# EAGLE design atmt (EAGLE 9.6.2)

## Sheet 1 of 2: MCU and power
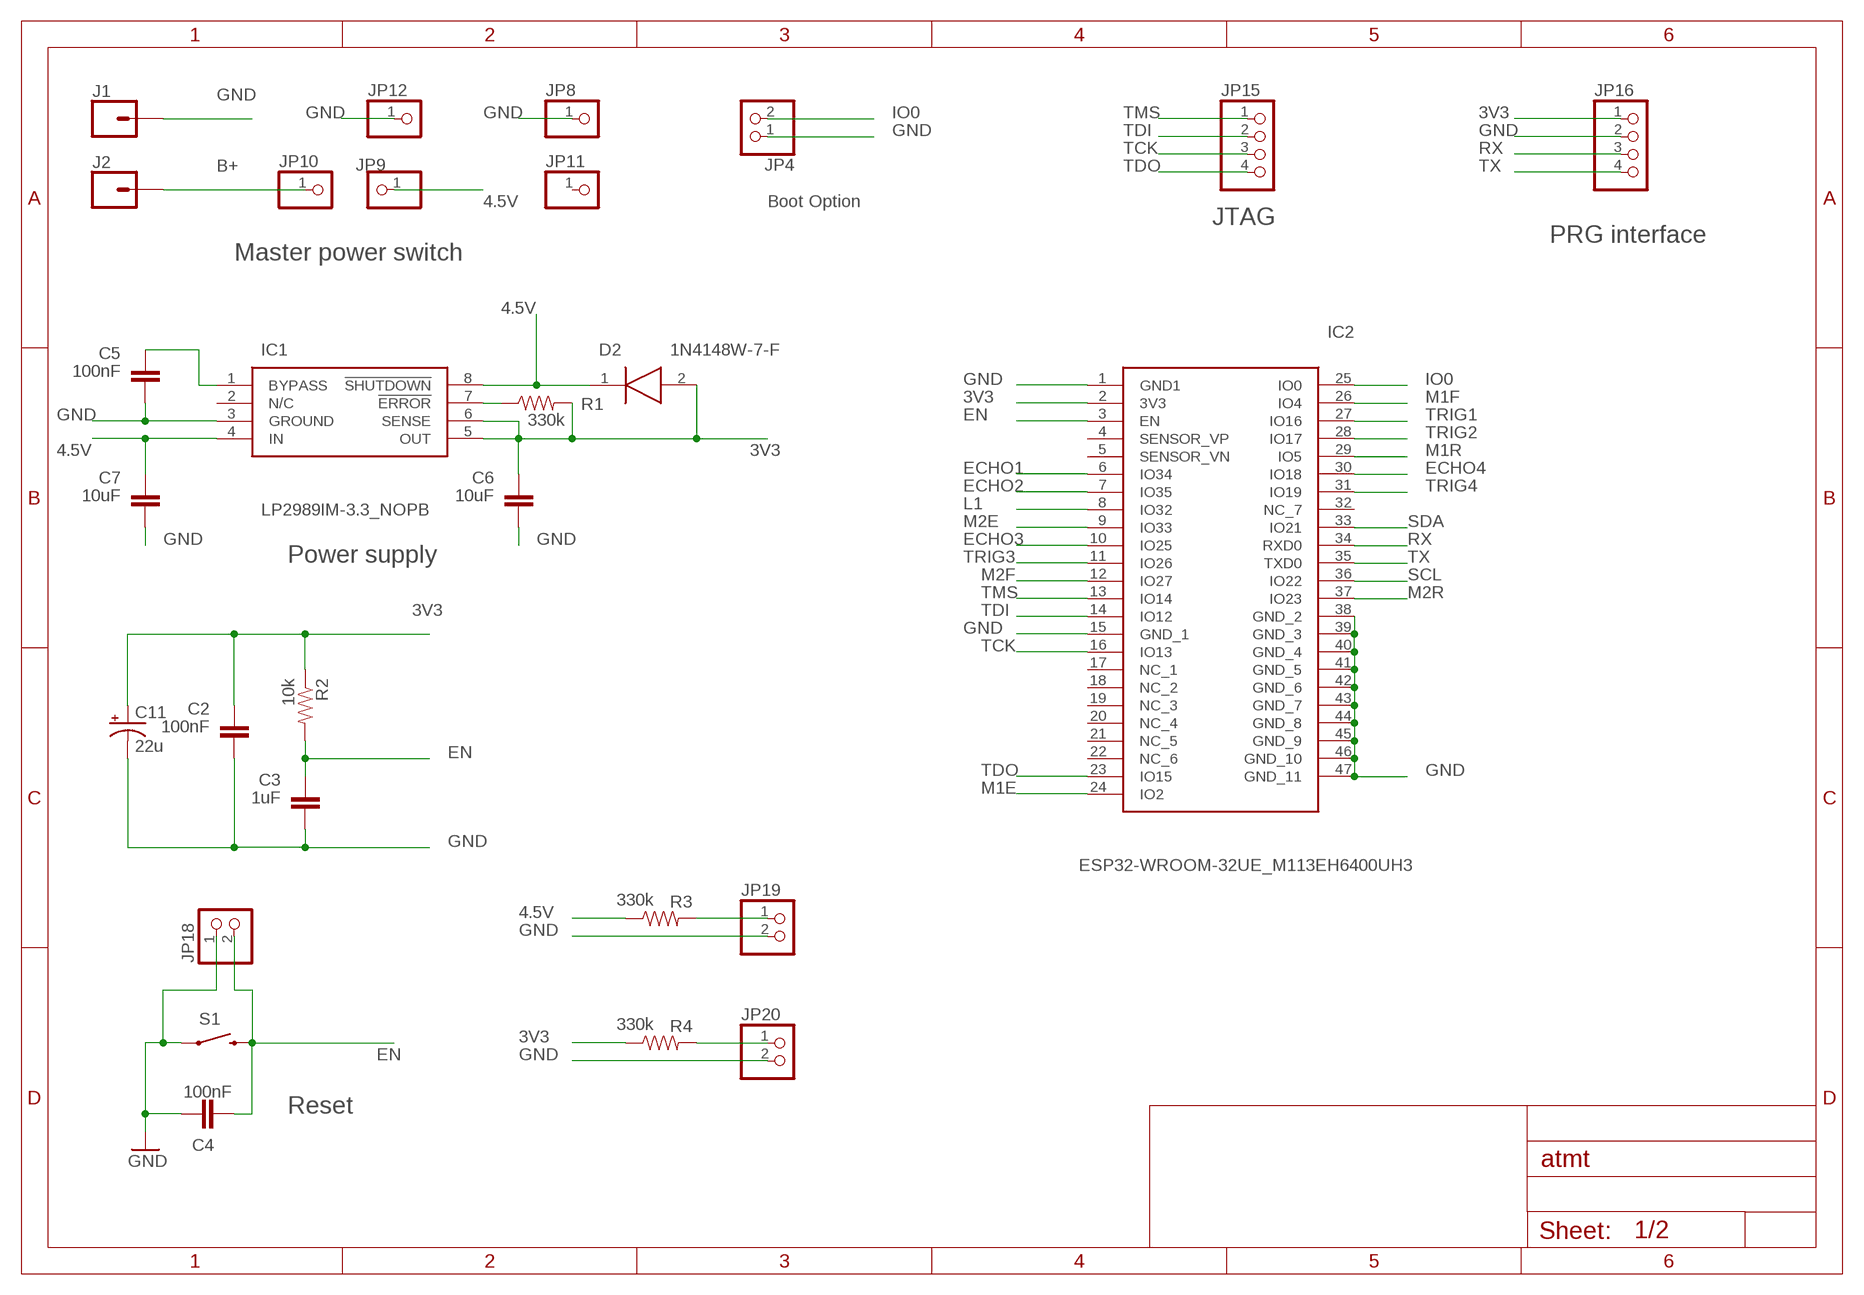
[diagram p0: schematic, sheet 1]

### Parts
C2  100nF  CAP0805  [0805]
C3  1uF  CAP0805  [0805]
C4  100nF  CAP0805  [0805]
C5  100nF  CAP0805  [0805]
C6  10uF  CAP0805  [0805]
C7  10uF  CAP0805  [0805]
C11  22u  CPOL-USE2-5  [E2-5]
D2  1N4148W-7-F  [SOD3716X115N]
IC1  LP2989IM-3.3_NOPB  [SOIC127P600X175-8N]
IC2  ESP32-WROOM-32UE_M113EH6400UH3  [ESP32WROOM32UEM113EH6400UH3Q0]
J1  CONN_01PTH_2MM  [1X01_2MM]
J2  CONN_01PTH_2MM  [1X01_2MM]
JP4  PINHD-1X2  [1X02]
JP8  PINHD-1X1  [1X01]
JP9  PINHD-1X1  [1X01]
JP10  PINHD-1X1  [1X01]
JP11  PINHD-1X1  [1X01]
JP12  PINHD-1X1  [1X01]
JP15  PINHD-1X4  [1X04]
JP16  PINHD-1X4  [1X04]
JP18  PINHD-1X2  [1X02]
JP19  PINHD-1X2  [1X02]
JP20  PINHD-1X2  [1X02]
R1  330k  RESISTOR0805-RES  [0805]
R2  10k  RESISTOR0805-RES  [0805]
R3  330k  RESISTOR0805-RES  [0805]
R4  330k  RESISTOR0805-RES  [0805]
S1  RESET  SWITCH-MOMENTARY-2SMD-1101NE  [TACTILE-SWITCH-1101NE]

### Nets
3V3: C2.1 C6.1 C11.+ D2.2(A) IC1.5(OUT) IC1.6(SENSE) IC2.2(3V3) JP16.1 R1.2 R2.1 R4.1 ; also sheet 2
4.5V: C7.1 D2.1(K) IC1.4(IN) IC1.8(!SHUTDOWN) JP9.1 R3.1 ; also sheet 2
B+: J2.1 JP10.1
ECHO1: IC2.6(IO34) ; also sheet 2
ECHO2: IC2.7(IO35) ; also sheet 2
ECHO3: IC2.10(IO25) ; also sheet 2
ECHO4: IC2.30(IO18) ; also sheet 2
EN: C3.1 C4.2 IC2.3(EN) JP18.2 R2.2 S1.2
GND: C2.2 C3.2 C4.1 C5.2 C6.2 C7.2 C11.- IC1.3(GROUND) IC2.1(GND1) IC2.15(GND_1) IC2.38(GND_2) IC2.39(GND_3) IC2.40(GND_4) IC2.41(GND_5) IC2.42(GND_6) IC2.43(GND_7) IC2.44(GND_8) IC2.45(GND_9) IC2.46(GND_10) IC2.47(GND_11) J1.1 JP4.1 JP8.1 JP12.1 JP16.2 JP18.1 JP19.2 JP20.2 S1.1 ; also sheet 2
IO0: IC2.25(IO0) JP4.2
L1: IC2.8(IO32) ; also sheet 2
M1E: IC2.24(IO2) ; also sheet 2
M1F: IC2.26(IO4) ; also sheet 2
M1R: IC2.29(IO5) ; also sheet 2
M2E: IC2.9(IO33) ; also sheet 2
M2F: IC2.12(IO27) ; also sheet 2
M2R: IC2.37(IO23) ; also sheet 2
N$1: C5.1 IC1.1(BYPASS)
N$2: JP19.1 R3.2
N$3: JP20.1 R4.2
N$4: IC1.7(!ERROR) R1.1
RX: IC2.34(RXD0) JP16.3
SCL: IC2.36(IO22) ; also sheet 2
SDA: IC2.33(IO21) ; also sheet 2
TCK: IC2.16(IO13) JP15.3
TDI: IC2.14(IO12) JP15.2
TDO: IC2.23(IO15) JP15.4
TMS: IC2.13(IO14) JP15.1
TRIG1: IC2.27(IO16) ; also sheet 2
TRIG2: IC2.28(IO17) ; also sheet 2
TRIG3: IC2.11(IO26) ; also sheet 2
TRIG4: IC2.31(IO19) ; also sheet 2
TX: IC2.35(TXD0) JP16.4
Unconnected: IC1.2(N/C) IC2.4(SENSOR_VP) IC2.5(SENSOR_VN) IC2.17(NC_1) IC2.18(NC_2) IC2.19(NC_3) IC2.20(NC_4) IC2.21(NC_5) IC2.22(NC_6) IC2.32(NC_7) JP11.1

### Notes on the sheet
- Boot Option
- JTAG
- PRG interface
- Master power switch
- Power supply
- Reset

## Sheet 2 of 2
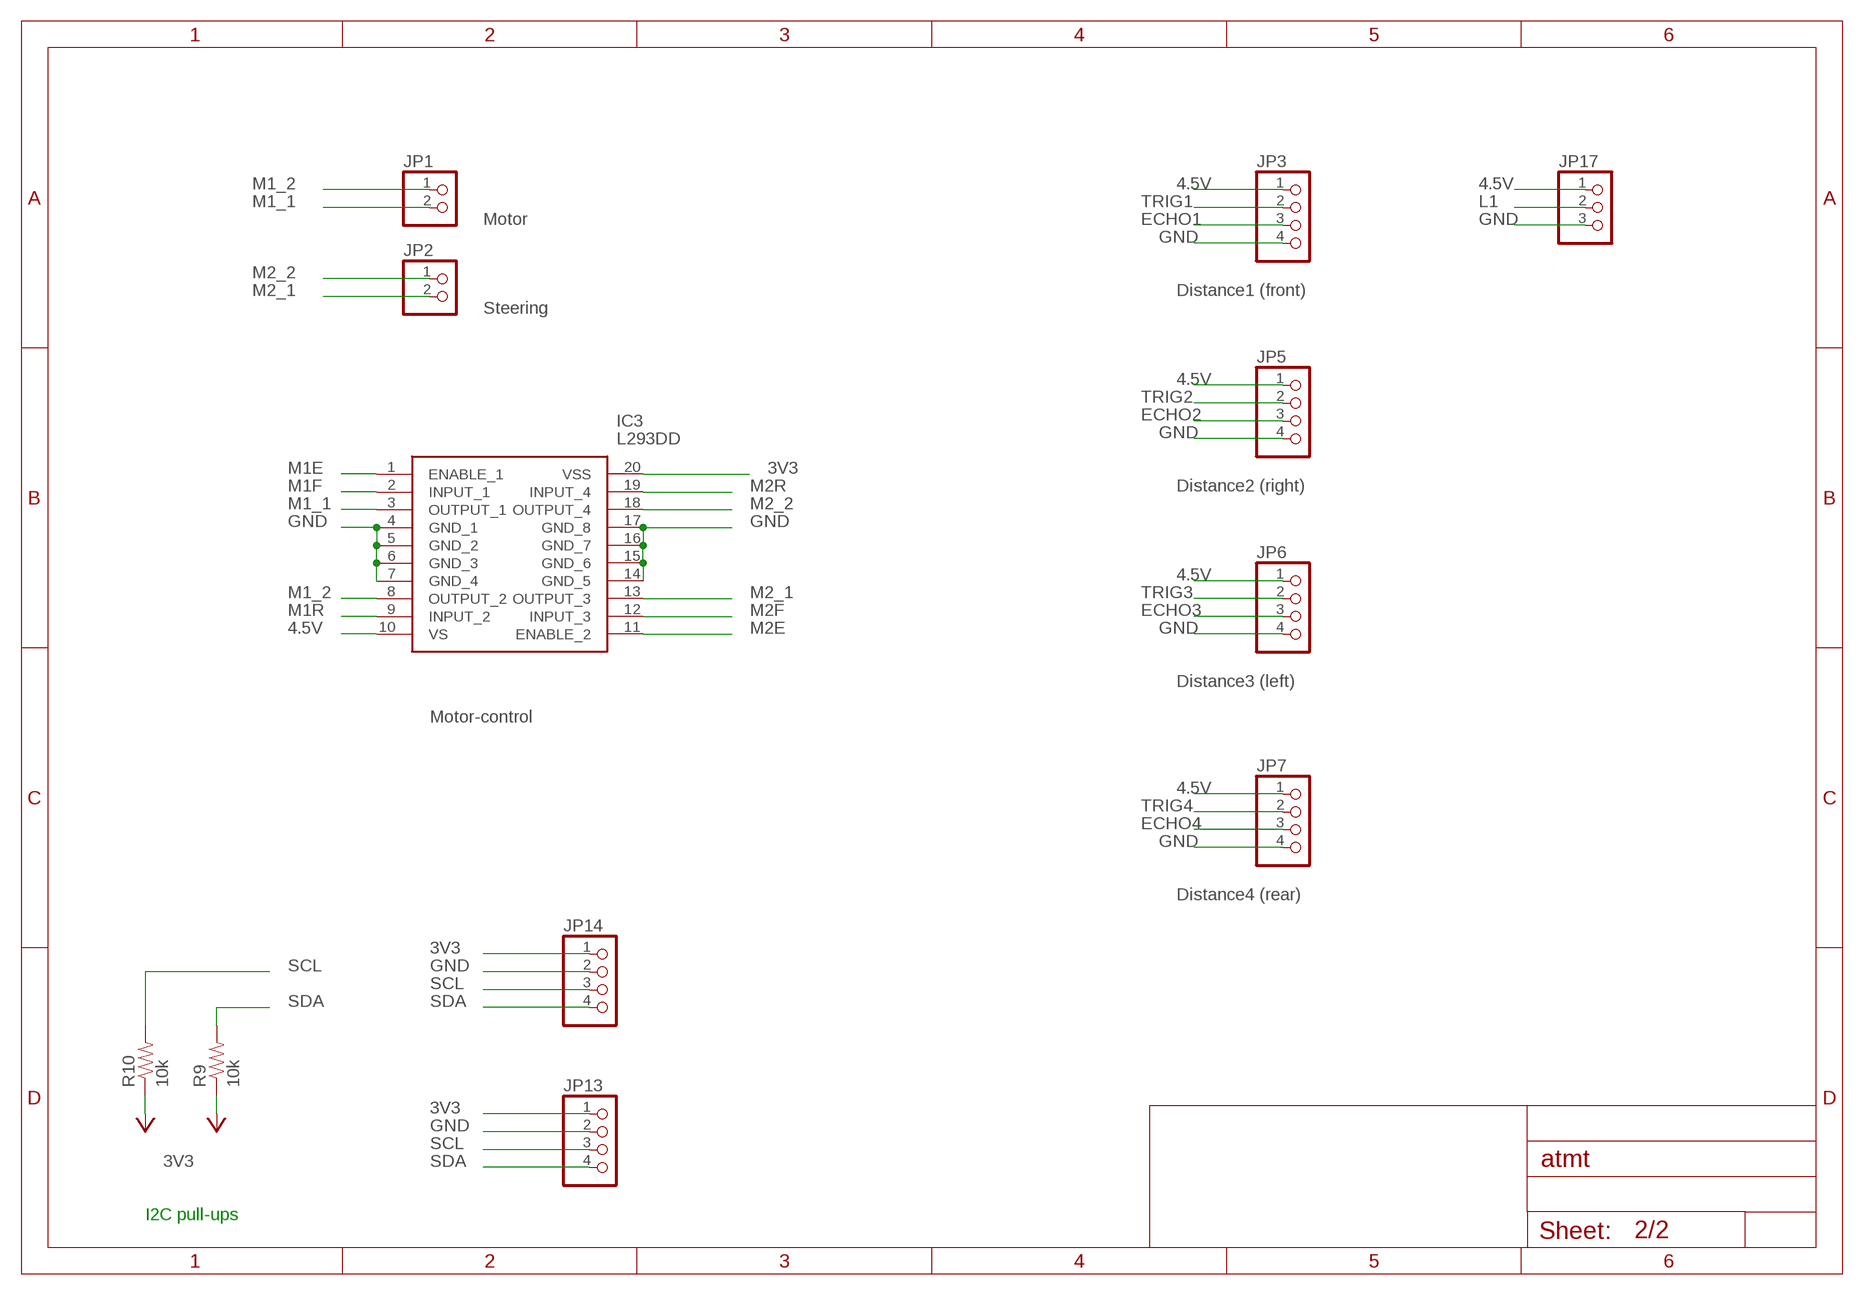
[diagram p1: schematic, sheet 2]

### Parts
IC3  L293DD  [SOIC127P1032X265-20N]
JP1  PINHD-1X2/90  [1X02/90]
JP2  PINHD-1X2/90  [1X02/90]
JP3  PINHD-1X4  [1X04]
JP5  PINHD-1X4  [1X04]
JP6  PINHD-1X4  [1X04]
JP7  PINHD-1X4  [1X04]
JP13  PINHD-1X4  [1X04]
JP14  PINHD-1X4  [1X04]
JP17  PINHD-1X3  [1X03]
R9  10k  RESISTOR0805-RES  [0805]
R10  10k  RESISTOR0805-RES  [0805]

### Nets
3V3: IC3.20(VSS) JP13.1 JP14.1 R9.1 R10.1 ; supply symbol labelled +3V3 ; also sheet 1
4.5V: IC3.10(VS) JP3.1 JP5.1 JP6.1 JP7.1 JP17.1 ; also sheet 1
ECHO1: JP3.3 ; also sheet 1
ECHO2: JP5.3 ; also sheet 1
ECHO3: JP6.3 ; also sheet 1
ECHO4: JP7.3 ; also sheet 1
GND: IC3.4(GND_1) IC3.5(GND_2) IC3.6(GND_3) IC3.7(GND_4) IC3.14(GND_5) IC3.15(GND_6) IC3.16(GND_7) IC3.17(GND_8) JP3.4 JP5.4 JP6.4 JP7.4 JP13.2 JP14.2 JP17.3 ; also sheet 1
L1: JP17.2 ; also sheet 1
M1_1: IC3.3(OUTPUT_1) JP1.2
M1_2: IC3.8(OUTPUT_2) JP1.1
M1E: IC3.1(ENABLE_1) ; also sheet 1
M1F: IC3.2(INPUT_1) ; also sheet 1
M1R: IC3.9(INPUT_2) ; also sheet 1
M2_1: IC3.13(OUTPUT_3) JP2.2
M2_2: IC3.18(OUTPUT_4) JP2.1
M2E: IC3.11(ENABLE_2) ; also sheet 1
M2F: IC3.12(INPUT_3) ; also sheet 1
M2R: IC3.19(INPUT_4) ; also sheet 1
SCL: JP13.3 JP14.3 R10.2 ; also sheet 1
SDA: JP13.4 JP14.4 R9.2 ; also sheet 1
TRIG1: JP3.2 ; also sheet 1
TRIG2: JP5.2 ; also sheet 1
TRIG3: JP6.2 ; also sheet 1
TRIG4: JP7.2 ; also sheet 1

### Notes on the sheet
- Motor
- Distance1 (front)
- Steering
- Distance2 (right)
- Distance3 (left)
- Motor-control
- Distance4 (rear)
- I2C pull-ups

## Library data of the parts
C2-C7 = SparkFun-Passives:CAP: Capacitor Standard 0603 ceramic capacitor, and 0.1" leaded capacitor.
C11 = rcl:CPOL-US: POLARIZED CAPACITOR, American symbol; SPICEPREFIX: C
D2 = SamacSys_Parts:1N4148W-7-F: Diode Switching 150mA 100V 400mW SOD123 Diodes Inc 1N4148W-7-F Switching Diode 100V, 2-Pin SOD-123 Source: Datasheet <https://componentsearchengine.com/Datasheets/1/1N4148W-7-F.pdf>; DESCRIPTION: Diode Switching 150mA 100V 400mW SOD123 Diodes Inc 1N4148W-7-F Switching Diode 100V, 2-Pin SOD-123; HEIGHT: 1.15mm; MANUFACTURER_NAME: Diodes Inc.; MANUFACTURER_PART_NUMBER: 1N4148W-7-F; MOUSER_PART_NUMBER: 621-1N4148W-F; MOUSER_PRICE-STOCK: https://www.mouser.com/Search/Refine.aspx?Keyword=621-1N4148W-F
IC1 = SamacSys_Parts:LP2989IM-3.3_NOPB: Micropower/Low Noise, 500 mA Ultra Low-Dropout Regulator Source: Datasheet <http://www.ti.com/lit/ds/symlink/lp2989.pdf>; DESCRIPTION: Micropower/Low Noise, 500 mA Ultra Low-Dropout Regulator; HEIGHT: 1.75mm; MANUFACTURER_NAME: Texas Instruments; MANUFACTURER_PART_NUMBER: LP2989IM-3.3/NOPB; MOUSER_PART_NUMBER: 926-2989IM-3.3/NOPB; MOUSER_PRICE-STOCK: https://www.mouser.co.uk/ProductDetail/Texas-Instruments/LP2989IM-33-NOPB?qs=1FNqv8aZn1Tm79MYQqSiDQ%3D%3D
IC2 = SamacSys_Parts:ESP32-WROOM-32UE_M113EH6400UH3: WiFi Modules (802.11) SMD module ESP32-WROOM-32UE, ESP32-D0WD-V3, ESP32 ECO V3, 8 MB SPI flash, IPEX antenna connector Source: Datasheet <https://www.espressif.com/sites/default/files/documentation/esp32-wroom-32e_esp32-wroom-32ue_datasheet_en.pdf>; DESCRIPTION: WiFi Modules (802.11) SMD module ESP32-WROOM-32UE, ESP32-D0WD-V3, ESP32 ECO V3, 8 MB SPI flash, IPEX antenna connector; HEIGHT: 3.35mm; MANUFACTURER_NAME: Espressif Systems; MANUFACTURER_PART_NUMBER: ESP32-WROOM-32UE(M113EH6400UH3Q0); MOUSER_PART_NUMBER: 356-ESP32WRM32UE64UH; MOUSER_PRICE-STOCK: https://www.mouser.co.uk/ProductDetail/Espressif-Systems/ESP32-WROOM-32UEM113EH6400UH3Q0?qs=vHuUswq2%252BsxjtHWnhz9C5Q%3D%3D
IC3 = SamacSys_Parts:L293DD: L293DD, Motor Driver, 4.5 36 V, 20-Pin SOIC Source: Datasheet <https://www.st.com/resource/en/datasheet/l293d.pdf>; DESCRIPTION: L293DD, Motor Driver, 4.5 36 V, 20-Pin SOIC; HEIGHT: 2.65mm; MANUFACTURER_NAME: STMicroelectronics; MANUFACTURER_PART_NUMBER: L293DD; MOUSER_PART_NUMBER: 511-L293DD; MOUSER_PRICE-STOCK: https://www.mouser.co.uk/ProductDetail/STMicroelectronics/L293DD?qs=m4gxtLzGBzoksItTiSkcgg%3D%3D
J1 J2 = SparkFun-Connectors:CONN_01: Single connection point. Often used as Generic Header-pin footprint for 0.1 inch spaced/style header connections On any of the 0.1 inch spaced packages, you can populate with these: Break Away Headers - Straight <https://www.sparkfun.com/products/116> (PRT-00116) Break Away Male Headers - Right Angle <https://www.sparkfun.com/products/553> (PRT-00553) Female Headers <https://www.sparkfun.com/products/115> (PRT-00115) Break Away Headers - Machine Pin <https://www.sparkfun.com/products/117> (PRT-00117) Break Away Female Headers - Swiss Machine Pin <https://www.sparkfun.com/products/743> (PRT-00743) This device is also useful as a general connection point to wire up your design to another part of your project. Our various solder wires solder well into these plated through hole pads. Hook-Up Wire - Assortment (Stranded, 22 AWG) <https://www.sparkfun.com/products/11375> (PRT-11375) Hook-Up Wire - Assortment (Solid Core, 22 AWG) <https://www.sparkfun.com/products/11367> (PRT-11367) View the entire wire category on our website here <https://www.sparkfun.com/categories/141> Special notes: SMTSO-256-ET is a "flush mount" nut for a 4-40 screw. We mostly use this on specialty testbeds; it is a nice way to connect hardware to your PCB at an adjustable hieght. Also note, the SNAP packages are for using a snappable style connector. We sell a baggie of snaps and they are also used on two LilyPad designs: Snap Assortment - 30 pack (male and female) <https://www.sparkfun.com/products/11347> (DEV-11347) LilyPad Arduino SimpleSnap <https://www.sparkfun.com/products/10941> (DEV-10941) LilyPad SimpleSnap Protoboard <https://www.sparkfun.com/products/10940> (DEV-10940)
JP1 JP2 JP4 JP18-JP20 = pinhead:PINHD-1X2: PIN HEADER
JP3 JP5-JP7 JP13-JP16 = pinhead:PINHD-1X4: PIN HEADER
JP8-JP12 = pinhead:PINHD-1X1: PIN HEADER
JP17 = pinhead:PINHD-1X3: PIN HEADER
R1-R4 R9 R10 = SparkFun-Resistors:RESISTOR: Resistor Basic schematic elements and footprints for 0603, 1206, and PTH resistors.
S1 = SparkFun-Electromechanical:SWITCH-MOMENTARY-2: Various NO switches- pushbuttons, reed, etc; PROD_ID: SWCH-00815

## Board
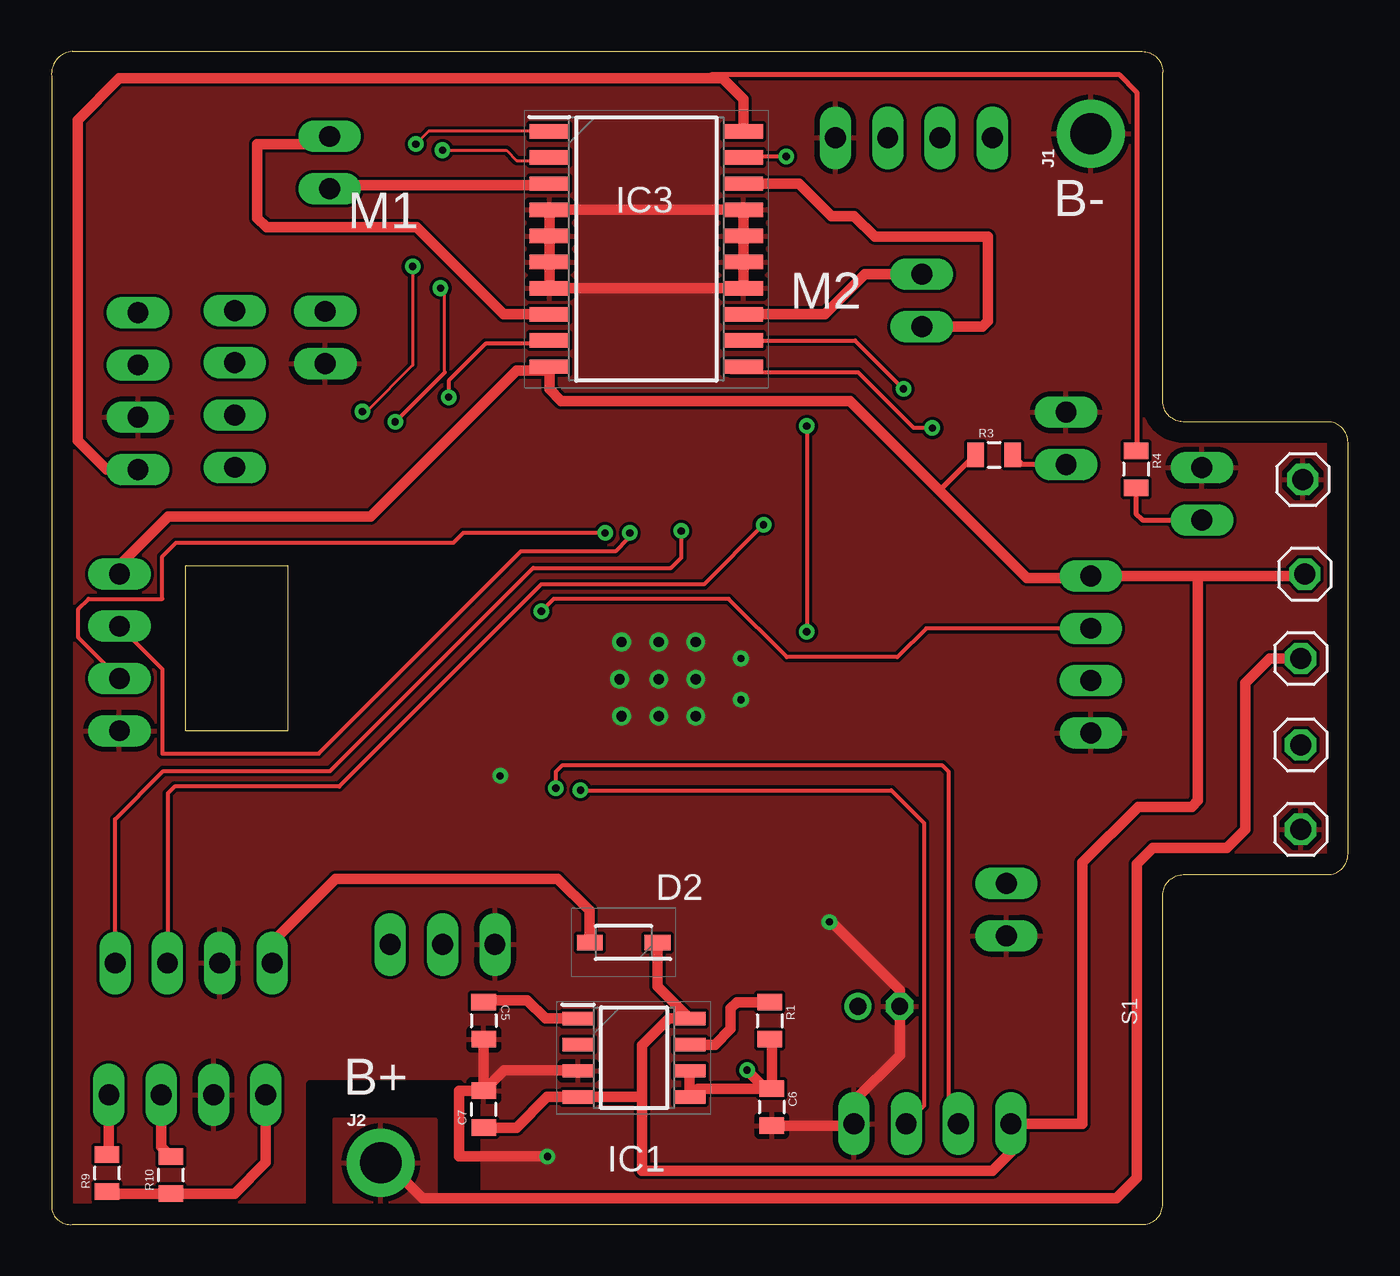
[diagram p2: board, top side]
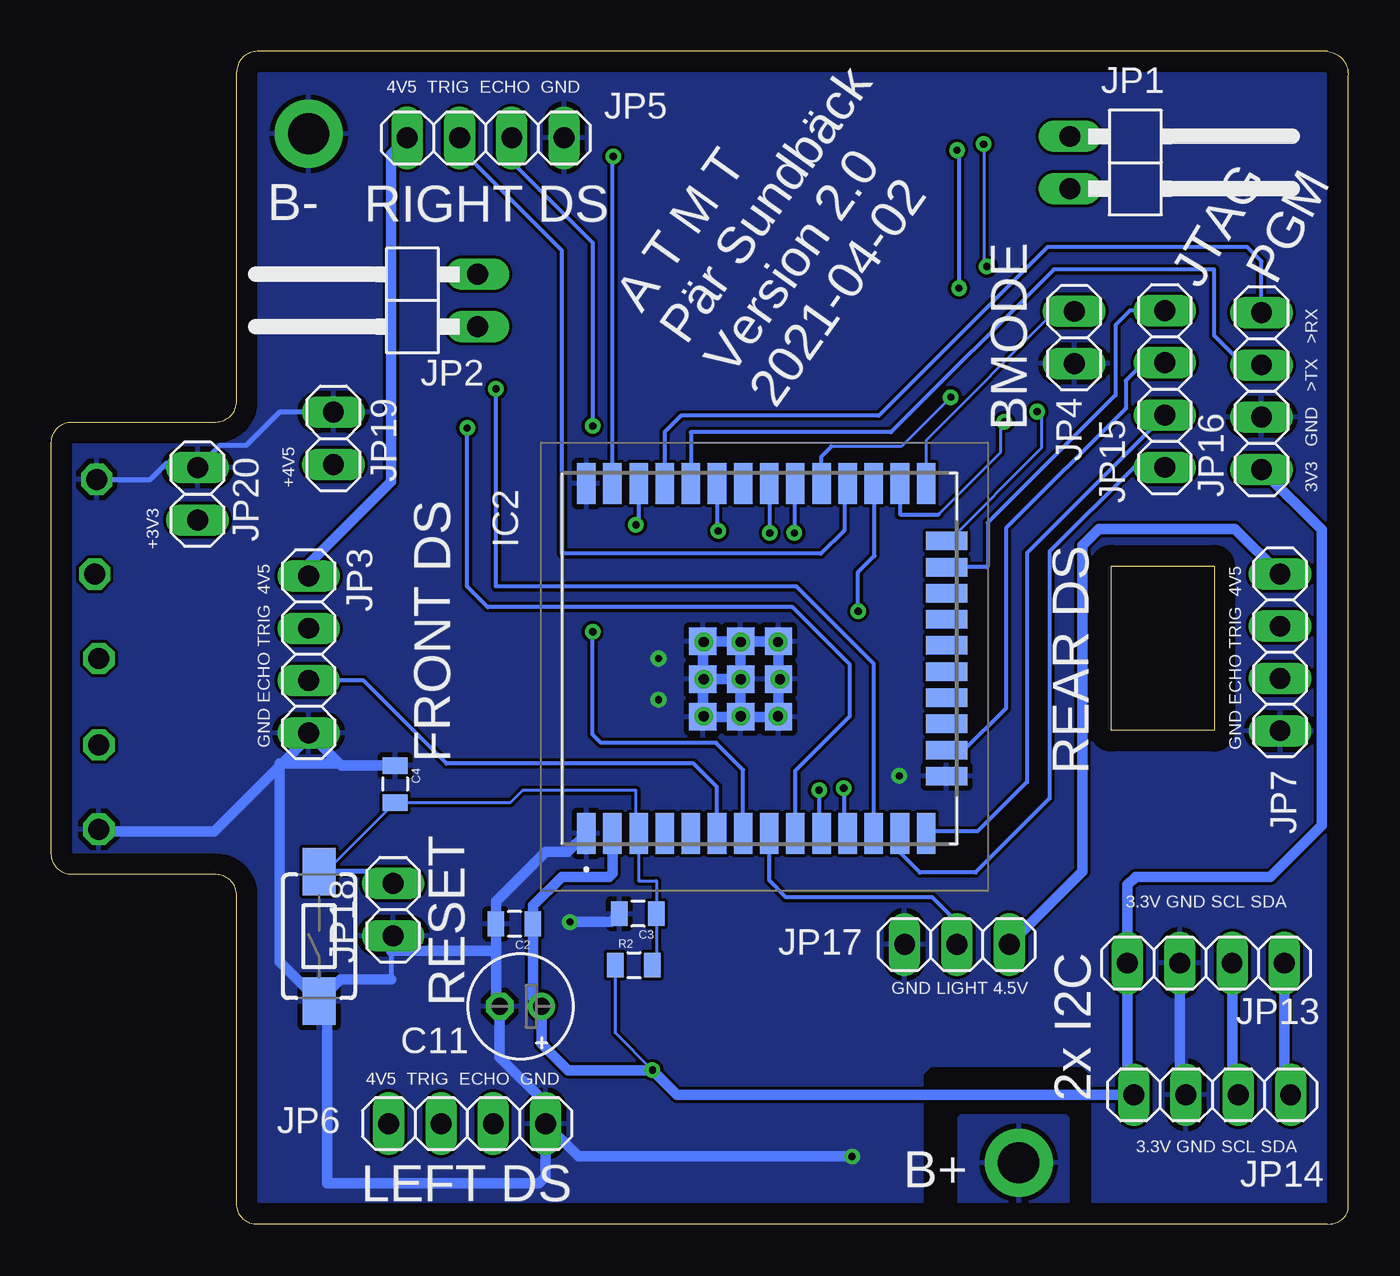
[diagram p3: board, bottom side, seen from below]

Size 63 x 57.01 mm. Coordinates in mm from the lower left corner, seen from the top.
Outline: 0,55.81 0,0.81 arc90 1,0.01 53,0.01 arc90 54,1.01 54,16.01 arc-90 55,17.01 62,17.01 arc90 63,18.01 63,38.01 arc90 62,39.01 55,39.01 arc-90 54,40.01 54,56.01 arc90 53,57.01 1,57.01 arc90 0,55.81
Outline: 6.5,32.01 6.5,24.01 11.5,24.01 11.5,32.01 6.5,32.01
Copper layers (1*16): Top 0.035mm / dielectric 1.5mm / Bottom 0.035mm
Design rules "default": minimum track width 6mil, minimum drill 0.35mm, track to track 6mil, track to pad 6mil, pad to pad 6mil, via to via 6mil, smd to smd 6mil, copper to edge 40mil, drill to drill 6mil, minimum pad ring 10mil, minimum via ring 8mil, stop-mask expansion 4mil, vias tented up to drill 0mil, thermal gap 10mil

### Footprints (pad centres in the part's own frame; a part is rotated, then mirrored left to right if it is on the bottom)
0805 = smd 0.8 x 1.2: 1 -0.9,0; 2 0.9,0
E2-5 = drill 0.813 pad 1.27: + -1.016,0 | drill 0.813 pad 1.27 octagon: - 1.016,0
SOD3716X115N = smd 1.25 x 0.75: 1 -1.65,0; 2 1.65,0
SOIC127P600X175-8N = smd 1.528 x 0.65: 1 -2.711,1.905; 2 -2.711,0.635; 3 -2.711,-0.635; 4 -2.711,-1.905; 5 2.711,-1.905; 6 2.711,-0.635; 7 2.711,0.635; 8 2.711,1.905
ESP32WROOM32UEM113EH6400UH3Q0 = smd 2 x 0.9: 1 -8.5,8.41; 2 -8.5,7.14; 3 -8.5,5.87; 4 -8.5,4.6; 5 -8.5,3.33; 6 -8.5,2.06; 7 -8.5,0.79; 8 -8.5,-0.48; 9 -8.5,-1.75; 10 -8.5,-3.02; 11 -8.5,-4.29; 12 -8.5,-5.56; 13 -8.5,-6.83; 14 -8.5,-8.1; 25 8.5,-8.1; 26 8.5,-6.83; 27 8.5,-5.56; 28 8.5,-4.29; 29 8.5,-3.02; 30 8.5,-1.75; 31 8.5,-0.48; 32 8.5,0.79; 33 8.5,2.06; 34 8.5,3.33; 35 8.5,4.6; 36 8.5,5.87; 37 8.5,7.14; 38 8.5,8.41 | smd 0.9 x 2: 15 -5.715,-9.1; 16 -4.445,-9.1; 17 -3.175,-9.1; 18 -1.905,-9.1; 19 -0.635,-9.1; 20 0.635,-9.1; 21 1.905,-9.1; 22 3.175,-9.1; 23 4.445,-9.1; 24 5.715,-9.1 | smd 1.33 x 1.33: 39 -1,0.91; 40 0.835,0.91; 41 0.835,2.745; 42 -1,2.745; 43 -2.835,2.745; 44 -2.835,0.91; 45 -2.835,-0.925; 46 -1,-0.925; 47 0.835,-0.925
SOIC127P1032X265-20N = smd 1.925 x 0.7: 1 -4.712,5.715; 2 -4.712,4.445; 3 -4.712,3.175; 4 -4.712,1.905; 5 -4.712,0.635; 6 -4.712,-0.635; 7 -4.712,-1.905; 8 -4.712,-3.175; 9 -4.712,-4.445; 10 -4.712,-5.715; 11 4.712,-5.715; 12 4.712,-4.445; 13 4.712,-3.175; 14 4.712,-1.905; 15 4.712,-0.635; 16 4.712,0.635; 17 4.712,1.905; 18 4.712,3.175; 19 4.712,4.445; 20 4.712,5.715
1X01_2MM = drill 2 pad 3.302: 1 0,0
1X02/90 = drill 1.016 long: 1 -1.27,-3.81; 2 1.27,-3.81
1X04 = drill 1.016 long: 1 -3.81,0; 2 -1.27,0; 3 1.27,0; 4 3.81,0
1X02 = drill 1.016 long: 1 -1.27,0; 2 1.27,0
1X01 = drill 1.016 octagon: 1 0,0
1X03 = drill 1.016 long: 1 -2.54,0; 2 0,0; 3 2.54,0
TACTILE-SWITCH-1101NE = smd 2.3 x 1.6: 1 -3.15,0; 2 3.15,0

### Placement (x,y rotation side)
C2  40.5,14.61 180 bottom
C3  34.5,15.11 180 bottom
C4  46.3,21.41 270 bottom
C5  21,9.91 270.3 top
C6  35,5.71 270 top
C7  21,5.61 90 top
C11  40.2,10.61 180 bottom
D2  27.8,13.71 180 top
IC1  28.3,8.11 0 top
IC2  28.6,27.51 90 bottom
IC3  28.9,47.41 0 top
J1  50.5,53.01 90 top
J2  16,3.01 0 top
JP1  9.7,51.61 270 bottom
JP2  46.1,44.91 90 bottom
JP3  50.5,27.71 270 bottom
JP4  13.3,43.11 90 bottom
JP5  41.9,52.81 0 bottom
JP6  42.8,4.91 0 bottom
JP7  3.3,27.81 270 bottom
JP8  60.8,36.21 0 top
JP9  60.9,31.61 0 top
JP10  60.7,27.51 0 top
JP11  60.7,23.31 0 top
JP12  60.7,19.21 0 top
JP13  6.9,12.71 0 bottom
JP14  6.6,6.31 0 bottom
JP15  8.9,40.61 90 bottom
JP16  4.2,40.51 90 bottom
JP17  19,13.61 180 bottom
JP18  46.4,15.31 90 bottom
JP19  49.3,38.21 90 bottom
JP20  55.9,35.51 90 bottom
R1  34.9,9.91 270 top
R2  34.7,12.61 0 bottom
R3  45.8,37.41 0 top
R4  52.7,36.71 270 top
R9  2.7,2.51 90 top
R10  5.8,2.41 90 top
S1  50,14.01 90 bottom

### Tracks (layer width: path | path; a pad name or v marks a point on that pad's centre or on a via)
3V3  (via drill 0.35)
  Top 0.254: R4.1 52.73,37.64 52.73,55.03 51.9,55.86 32.06,55.86 31.9,55.71
  Top 0.508: IC1.6 IC1.5 31.42,6.61 C6.1 | R1.2 35,8.91 C6.1 | v33.8,7.51 34.7,6.61 C6.1 | R9.1 2.8,1.51 R10.1 8.9,1.51 10.41,3.02 JP14.1 | JP16.1 2.68,36.7 1.27,38.11 1.27,53.68 3.3,55.71 31.9,55.71 32.6,55.71 33.62,54.69 IC3.20 | JP13.1 10.71,13.72 13.8,16.81 24.6,16.81 26.15,15.26 D2.2
  Bottom 0.152: v33.8,7.51 35.6,9.31 R2.1
  Bottom 0.508: IC2.2 35.74,17.07 35.9,16.91 38.2,16.91 39.6,15.51 C2.1 39.6,11.02 C11.+ 39.19,8.79 37.9,7.51 v33.8,7.51 32.6,6.31 JP14.1 10.71,6.61 JP13.1 10.71,16.5 10.3,16.91 3.77,16.91 1.27,19.41 1.27,33.77 JP16.1
4.5V
  Top 0.254: R3.1 43.15,35.66
  Top 0.508: 28.7,6.21 28.7,2.61 45.71,2.61 46.61,3.51 JP6.1 50.1,4.91 50.1,17.61 52.8,20.31 55.4,20.31 55.7,20.61 55.7,31.52 | 28.7,6.21 28.7,8.71 30.01,10.01 IC1.8 29.45,11.57 D2.1 | 28.7,6.21 IC1.4 24.09,6.2 22.6,4.71 C7.1 | IC3.10 24.19,41.51 | 24.19,41.51 24.19,40.59 24.77,40.01 38.8,40.01 43.15,35.66 47.4,31.41 50.39,31.41 JP3.1 55.7,31.52 | JP7.1 3.23,31.69 3.23,31.98 5.66,34.41 15.5,34.41 22.6,41.51 24.19,41.51 | 55.7,31.52 60.81,31.52 JP9.1
  Bottom 0.508: JP5.1 46.5,52.02 46.5,36.11 50.5,32.11 JP3.1 | JP17.1 12.9,17.17 12.9,33.01 12.1,33.81 5.49,33.81 JP7.1
B+
  Top 0.508: J2.1 16.3,3.01 18.03,1.28 51.73,1.28 52.73,2.28 52.73,17.53 53.51,18.31 57.1,18.31 58,19.21 58,26.31 59.2,27.51 JP10.1
  pour Top: 13.7,5.11 13.7,1.11 18.7,1.11 18.7,5.11
  pour Bottom: 13.6,5.21 13.6,0.91 18.8,0.91 18.9,1.01 18.9,5.21 18.8,5.31 13.7,5.31
ECHO1
  Bottom 0.2: IC2.6 30.66,21.27 31.8,22.41 43.8,22.41 47.83,26.44 JP3.3
ECHO2  (via drill 0.35)
  Top 0.2: v36.7,38.81 v36.7,28.81
  Bottom 0.2: JP5.3 40.4,52.58 40.4,51.41 36.7,47.71 v36.7,38.81 | IC2.7 29.39,22.1 30.7,23.41 36.3,23.41 36.7,23.81 v36.7,28.81
ECHO3  (via drill 0.35)
  Top 0.2: v25.7,21.11 40.8,21.11 42.4,19.51 42.4,5.78 JP6.3
  Bottom 0.2: v25.7,21.11 25.7,19.13 IC2.10
ECHO4  (via drill 0.35)
  Top 0.2: JP7.3 1.3,28.54 1.3,29.91 1.8,30.41 5.39,30.41 5.39,32.47 6.04,33.12 19.52,33.12 20,33.61 v26.9,33.61
  Bottom 0.2: IC2.30 26.9,35.96 v26.9,33.61
EN
  Bottom 0.152: R2.2 33.6,12.81 C3.1 33.6,16.71 34.47,16.71 IC2.3 34.6,19.14 34.6,21.11 40.1,21.11 40.7,20.51 C4.2 49.65,17.16 S1.2
  Bottom 0.254: JP18.2 46.98,17.16 S1.2
GND  (via drill 0.35, 0.5)
  Top 0.508: C5.2 C7.2 | C7.2 19.8,6.51 19.8,3.31 v24.1,3.31 | C7.2 22,7.51 25.56,7.51 IC1.3 | C6.2 38.89,4.81 JP6.4 38.99,6.01 41.22,8.23 C11.- 41.22,11.39 37.9,14.71 v37.8,14.71 | IC3.4 IC3.5 IC3.6 IC3.7 IC3.14 IC3.15 IC3.16 IC3.17 IC3.4
  Bottom 0.254: JP18.1 46.5,13.94 46.5,13.31 46.5,11.91 | JP8.1 58.2,36.21 57.4,37.01 56.13,37.01 JP20.2 54.82,37.86 53.53,37.86 51.92,39.48 JP19.2
  Bottom 0.508: JP13.2 8.17,6.61 JP14.2 | JP6.4 38.99,2.32 39.3,2.01 49.6,2.01 49.6,10.46 S1.1 | 41.4,13.31 46.5,13.31 | 46.5,11.91 48.95,11.91 S1.1 | 49.01,22.41 JP3.4 50.5,23.71 55.1,19.11 60.6,19.11 JP12.1 | 49.01,22.41 48.91,22.31 C4.1 | 49.01,22.41 51.9,22.41 51.9,12.76 S1.1 | v24.1,3.31 37.39,3.31 JP6.4 | IC2.1 37.91,18.11 39,18.11 41.4,15.71 C2.2 41.4,13.31 | v37.8,14.71 35.8,14.71 C3.2 | IC2.40 IC2.47 IC2.46 IC2.45 IC2.44 | IC2.40 IC2.41 IC2.42 | IC2.42 IC2.43 IC2.44 | IC2.39 IC2.44 | IC2.40 IC2.39 | IC2.39 IC2.42 | 41.4,13.31 41.4,10.79 C11.- 41.22,8.13 38.99,5.91 JP6.4
  other vias: 21.8,21.81 31.3,28.31 27.6,26.51 27.7,28.31 29.5,28.31 29.5,26.51 31.3,26.51 27.7,24.71 29.5,24.71 31.3,24.71 33.5,27.51 33.5,25.51
  pour Top: -1.1,56.31 -1.1,0.81 0.7,-0.99 10.6,-0.99 10.9,-0.69 12.3,0.71 12.3,6.91 12.5,7.11 19.9,7.11 20.9,6.11 20.9,-0.59 21.4,-1.09 54.3,-1.09 64.6,9.21 64.6,54.11 60.7,58.01 0.1,58.01 -1.1,56.81
  pour Bottom: -2,57.31 -2,-1.19 -2.1,-1.29 12.1,-1.29 12.4,-0.99 12.4,7.21 12.9,7.71 20.3,7.71 20.7,7.31 20.7,-1.29 56.1,-1.29 56.4,-0.99 64.6,7.21 64.6,24.11 64.6,57.01 62.9,58.71 -0.6,58.71
IO0
  Bottom 0.152: JP4.2 14.23,44.38 20.5,38.11 IC2.25
L1
  Bottom 0.2: JP17.2 19,14.71 20.2,15.91 27.3,15.91 28.12,16.73 IC2.8
M1_1
  Top 0.508: IC3.3 24.12,50.51 13.68,50.51 JP1.2
M1_2
  Top 0.508: IC3.8 21.98,44.23 17.75,48.46 10.45,48.46 10,48.91 10,52.51 13.14,52.51 JP1.1
M1E  (via drill 0.35)
  Top 0.152: IC3.1 18.32,53.12 v17.7,52.51 | v17.55,46.56 17.55,41.76 15.3,39.51 v15.1,39.51
  Bottom 0.152: v17.7,52.51 17.7,46.41 v17.55,46.56 | v15.1,39.51 14.9,39.31 14.9,37.72 19.4,33.22 IC2.24
M1F  (via drill 0.35)
  Top 0.152: 19.1,41.41 19.1,45.51 v18.9,45.51 | v19,52.21 22.1,52.21 22.6,51.71 24.05,51.71 IC3.2
  Top 0.2: v16.7,39.01 19.1,41.41
  Bottom 0.152: v16.7,39.01 16.9,38.81 16.9,37.51 19.9,34.51
  Bottom 0.2: IC2.26 21.77,34.51 19.9,34.51 | v19,52.21 18.9,52.11 v18.9,45.51
M1R  (via drill 0.35)
  Top 0.152: IC3.9 24.04,42.81
  Top 0.2: 24.04,42.81 21.1,42.81 19.3,41.01 v19.3,40.21
  Bottom 0.152: v19.3,40.21 21.7,37.81 25.1,37.81 | 25.6,36.03 IC2.29
  Bottom 0.2: 25.1,37.81 25.6,37.31 25.6,36.03
M2_1
  Top 0.508: IC3.13 37.59,44.23 39.53,46.18 JP2.2
M2_2
  Top 0.508: IC3.18 36.33,50.58 37.9,49.01 39,49.01 40,48.01 45.5,48.01 45.5,43.91 45.23,43.64 JP2.1
M2E  (via drill 0.35)
  Top 0.2: v42.8,38.71 41.9,38.71 39.2,41.41 33.03,41.41 33.32,41.69 IC3.11
  Bottom 0.2: IC2.9 26.85,22.06 24.2,24.71 24.2,27.21 27,30.01 41.8,30.01 42.8,31.01 v42.8,38.71
M2F  (via drill 0.35)
  Top 0.2: IC3.12 39.05,42.96 v41.4,40.61
  Bottom 0.2: IC2.12 23.04,27.25 26.8,31.01 41.4,31.01 v41.4,40.61
M2R  (via drill 0.35)
  Top 0.2: IC3.19 33.67,51.91 v35.7,51.91
  Bottom 0.2: IC2.37 35.74,51.87 v35.7,51.91
N$1
  Top 0.508: IC1.1 24,10.01 23.1,10.91 21.1,10.91 C5.1
N$2
  Top 0.254: JP19.1 47.17,36.94 R3.2
N$3
  Top 0.254: JP20.1 53,34.24 52.7,34.54 R4.2
N$4
  Top 0.508: IC1.7 32.24,8.74 33,9.51 33,10.51 33.3,10.81 R1.1
RX
  Bottom 0.2: JP16.3 5.07,41.78 6.5,43.21 6.5,46.41 14.3,46.41 22.2,38.51 31.93,38.51 IC2.34
SCL  (via drill 0.35)
  Top 0.2: v34.6,34.01 31.7,31.11 23.8,31.11 13.98,21.28 5.98,21.28 5.65,20.96 5.65,12.73 JP13.3
  Top 0.508: JP14.3 5.33,3.78 R10.2
  Bottom 0.2: IC2.36 34.47,34.14 v34.6,34.01
  Bottom 0.508: JP13.3 5.63,6.61 JP14.3
SDA  (via drill 0.35)
  Top 0.2: JP13.4 3.09,19.7 5.44,22.04 13.53,22.04 23.4,31.91 30.1,31.91 30.6,32.41 v30.6,33.71
  Top 0.508: JP14.4 2.79,3.5 R9.2
  Bottom 0.2: IC2.33 30.66,33.77 v30.6,33.71
  Bottom 0.508: JP13.4 3.09,6.61 JP14.4
TCK
  Bottom 0.2: JP15.3 9.93,41.88 10.8,41.01 10.8,39.66 16.62,33.84 16.62,25.09 18.7,23.01 19.45,23.01 IC2.16
TDI
  Bottom 0.2: JP15.2 15.6,32.64 15.6,21.51 18,19.11 20.4,19.11 IC2.14
TDO
  Bottom 0.2: JP15.4 10.59,44.42 11.3,43.71 11.3,40.31 17.5,34.11 17.5,32.01 17.56,31.95 IC2.23
TMS
  Bottom 0.2: JP15.1 10.4,36.8 14.5,32.7 14.5,20.71 18.1,17.11 20.8,17.11 21.77,18.08 IC2.13
TRIG1  (via drill 0.35)
  Top 0.2: JP3.2 42.5,28.98 41.1,27.58 35.73,27.58 32.9,30.41 24.4,30.41 v23.8,29.81
  Bottom 0.2: v23.8,29.81 23.8,31.71 23,32.51 23,35.97 IC2.27
TRIG2
  Bottom 0.2: IC2.28 24.48,35.84 24.48,33.74 25.61,32.61 38.2,32.61 38.2,47.34 43.17,52.31 JP5.2
TRIG3  (via drill 0.35)
  Top 0.2: JP6.2 43.6,5.38 43.6,22.01 43.3,22.31 24.8,22.31 24.5,22.01 v24.5,21.21
  Bottom 0.2: v24.5,21.21 24.5,19.2 IC2.11
TRIG4  (via drill 0.35)
  Top 0.2: JP7.2 5.39,26.99 5.39,22.89 12.99,22.89 22.8,32.71 27.4,32.71 28,33.31 28,33.51 v28.1,33.61
  Bottom 0.2: IC2.31 28.1,35.99 v28.1,33.61
TX
  Bottom 0.2: JP16.4 4.2,46.81 4.9,47.51 14.6,47.51 22.8,39.31 32.4,39.31 33.2,38.51 IC2.35

### Text on the board
tNames: B- | M1 | M2 | B+
bNames: 4V5 TRIG ECHO GND | RIGHT DS | B- | PGM | JTAG | 3V3 GND >TX >RX | A T M T / Pär Sundbäck / Version 2.0 / 2021-04-02 | BMODE | +4V5 | FRONT DS | +3V3 | GND ECHO TRIG 4V5 | GND ECHO TRIG 4V5 | REAR DS | RESET | 3.3V GND SCL SDA | GND LIGHT 4.5V | 4V5 TRIG ECHO GND | 2x I2C | 3.3V GND SCL SDA | LEFT DS | B+